# Altium schematic sheet Offset_Selector.SchDoc: Offset
size 420 x 297 mm; CheckedBy: G. Kasprowicz; Author: Jakub Kajzer; CompanyName: WUT ISE; DrawnBy: Jakub Kajzer; Organization: WUT ISE; Address1: PW ISE; Address2: Nowowiejska 15/19 00-665 Warsaw; Address3: gkasprow@gmail.com; DocumentNumber: 4; Revision: 2; SheetNumber: 4; SheetTotal: 7; ModifiedBy: -; CreateDate: 03.08.2020; CheckedDate: -; Title2: Selector; DivGrp: WUT ISE; Designer: Jakub Kajzer; ModifiedDate: -; ProjectName: Sensor Box
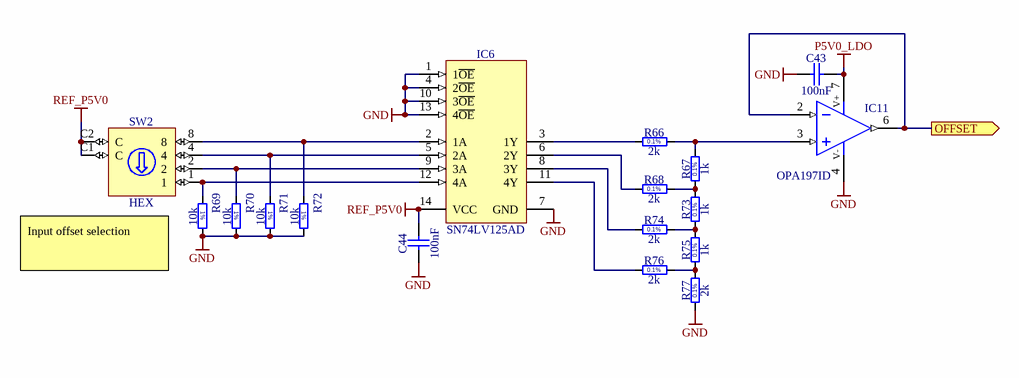
[diagram p0: Offset_Selector.SchDoc]

## Parts
C43  100nF  [CAPC1608X87N]
C44  100nF  [CAPC1608X87N]
IC6  SN74LV125AD  [SOIC127P600X175-14N]
IC11  OPA197ID  [SOIC127P600X175-8N]
R66  2k  [RESC1608X55N]
R67  1k  [RESC1608X55N]
R68  2k  [RESC1608X55N]
R69  10k  [RESC1608X55N]
R70  10k  [RESC1608X55N]
R71  10k  [RESC1608X55N]
R72  10k  [RESC1608X55N]
R73  1k  [RESC1608X55N]
R74  2k  [RESC1608X55N]
R75  1k  [RESC1608X55N]
R76  2k  [RESC1608X55N]
R77  2k  [RESC1608X55N]
SW2  HEX  [SW_APEM_PT65106L254]

## Ports
OFFSET (out)

## Nets
GND: C43.1 C44.1 IC6.1(1~{OE}) IC6.4(2~{OE}) IC6.7(GND) IC6.10(3~{OE}) IC6.13(4~{OE}) IC11.4(V-) R69.2 R70.2 R71.2 R72.2 R77.1
P5V0_LDO: C43.2 IC11.7(V+)
REF_P5V0: C44.2 IC6.14(VCC) SW2.C1(C) SW2.C2(C)
OFFSET: IC11.2(IN-) IC11.6(OUT) ; port OFFSET
NetIC6_2: IC6.2(1A) R72.1 SW2.8
NetIC6_3: IC6.3(1Y) R66.1
NetIC6_5: IC6.5(2A) R71.1 SW2.4
NetIC6_6: IC6.6(2Y) R68.1
NetIC6_8: IC6.8(3Y) R74.1
NetIC6_9: IC6.9(3A) R70.1 SW2.2
NetIC6_11: IC6.11(4Y) R76.1
NetIC6_12: IC6.12(4A) R69.1 SW2.1
NetIC11_3: IC11.3(IN+) R66.2 R67.2
NetR67_1: R67.1 R68.2 R73.2
NetR73_1: R73.1 R74.2 R75.2
NetR75_1: R75.1 R76.2 R77.2

## Notes on the sheet
- Input offset selection
- Project/Equipment
- Document
- Designer
- Drawn by
- Check.by
- Copyright WUT ISE 2018.
  This documentation describes Open Hardware and is licensed under the CERN OHL v.1.1. You may redistribute and modify this documentation under the terms of the CERN OHL v.1.1. (http://ohwr.org/CERNOHL). This documentation is distributed WITHOUT ANY EXPRESS OR IMPLIED WARRANTY, INCLUDING OF MERCHANTABILITY, SATISFACTORY QUALITY AND FITNESS FOR A PARTICULAR PURPOSE. Please see the CERN OHL v.1.1 for applicable conditions.
- Contact
- File
- Last Mod.
- Print Date
- Sheet
- Size
- A3
- of
- Rev
- (in symbol R0603_1K0_0.1%_0.063W_10PPM) 0.1%
- (in symbol R0603_2K_0.1%_0.063W_10PPM) 0.1%
- (in symbol R0603_10K_1%_0.1W_100PPM) 1%

## Library data of the parts
C43 C44 = CC0603_100NF_50V_10%_X7R: Non-polarised capacitor; Part Description: SMD Multilayer Chip Ceramic Capacitor; Manufacturer: GENERIC; Manufacturer1 Part Number: 223858615649; Voltage: 50V; TC: X7R; Tolerance: ±10%; Part Number: CC0603_100NF_50V_10%_X7R; Component Kind: Standard; Component Type: Standard; Pin Count: 2; Value: 100nF; Status: Preferred; Manufacturer Part Number: CC0603_100NF_50V_10%_X7R; Case: 0603; Mounted: Yes; Socket: No; SMD: Yes; Sense: No; Manufacturer1 Example: PHYCOMP; Manufacturer1 ComponentHeight: 0.87mm; HelpURL: \\cern.ch\dfs\Applications\Altium\Datasheets\CC0603_X7R_PHYCOMP.pdf; Author: CERN DEM JLC; CreateDate: 03/12/2007; LatestRevisionDate: 03/12/2007
IC6 = SN74LV125AD: Quadruple Bus Buffer with 3-State Outputs; Manufacturer: TEXAS INSTRUMENTS; PressFit: No; Bonding: No; Part Number: SN74LV125AD; Component Kind: Standard; Component Type: Standard; Device: SN74LV125AD; PackageDescription: SOIC 14, Pitch 1.27mm - Body 4x8.75mm, IPC Medium Density; Part Description: Quadruple Bus Buffer with 3-State Outputs; Manufacturer Part Number: SN74LV125AD; Pin Count: 14; Case: SOIC14; Mounted: Yes; Socket: No; SMD: Yes; Sense: No; ComponentHeight: 1.75mm; Author: CERN DEM JLC; HelpURL: \\cern.ch\dfs\Applications\Altium\Datasheets\SN74LV125AD.pdf; CreateDate: 09.03.2011; LatestRevisionDate: 09.03.2011
IC11 = OPA197ID: Operational Amplifier; Part Description: 36-V, Precision, Rail-to-Rail Input/Output, Low Offset Voltage, Operational Amplifiers; Manufacturer: TEXAS INSTRUMENTS; PressFit: No; Bonding: No; Part Number: OPA197ID; Component Kind: Standard; Component Type: Standard; Device: OPA197ID; PackageDescription: SOIC 8, Pitch 1.27mm - Body 4x5mm, IPC Medium Density; Manufacturer Part Number: OPA197ID; Pin Count: 8; Case: SOIC8; Mounted: Yes; Socket: No; SMD: Yes; Sense: No; ComponentHeight: 1.75mm; Author: CERN DEM MR; HelpURL: \\cern.ch\dfs\Applications\Altium\Datasheets\OPA197ID.pdf; CreateDate: 30/06/2017; LatestRevisionDate: 30/06/2017
R66 R68 R74 R76 R77 = R0603_2K_0.1%_0.063W_10PPM: Resistor - 0.1%; Part Description: Thin Film Chip Resistor; Manufacturer: GENERIC; Manufacturer1 Part Number: RN73C1J2K0BTDF; Power: 0.063W; TC: ±10ppm; PressFit: No; Part Number: R0603_2K_0.1%_0.063W_10PPM; Component Kind: Standard; Component Type: Standard; Pin Count: 2; Value: 2k; Status: Not Recommended; Tolerance: ±0.1%; Manufacturer Part Number: R0603_2K_0.1%_0.063W_10PPM; Case: 0603; Mounted: Yes; Sense: No; Socket: No; SMD: Yes; Manufacturer1 Example: TYCO HOLSWORTHY; Manufacturer1 ComponentHeight: 0.5mm; HelpURL: \\cern.ch\dfs\Applications\Altium\Datasheets\R0603_Tyco_RN73.pdf; Author: CERN DEM JLC; CreateDate: 03.12.2007; LatestRevisionDate: 13.03.2008
R67 R73 R75 = R0603_1K0_0.1%_0.063W_10PPM: Resistor - 0.1%; Part Description: Thin Film Chip Resistor; Manufacturer: GENERIC; Manufacturer1 Part Number: RN73C1J1K0BTDF; Power: 0.063W; TC: ±10ppm; PressFit: No; Part Number: R0603_1K0_0.1%_0.063W_10PPM; Component Kind: Standard; Component Type: Standard; Pin Count: 2; Value: 1k; Status: Not Recommended; Tolerance: ±0.1%; Manufacturer Part Number: R0603_1K0_0.1%_0.063W_10PPM; Case: 0603; Mounted: Yes; Sense: No; Socket: No; SMD: Yes; Manufacturer1 Example: TYCO HOLSWORTHY; Manufacturer1 ComponentHeight: 0.5mm; HelpURL: \\cern.ch\dfs\Applications\Altium\Datasheets\R0603_Tyco_RN73.pdf; Author: CERN DEM JLC; CreateDate: 03.12.2007; LatestRevisionDate: 13.03.2008
R69-R72 = R0603_10K_1%_0.1W_100PPM: Resistor - 1%; Part Description: General Purpose Thick Film Chip Resistor; Manufacturer: GENERIC; Manufacturer1 Part Number: NRC06F1002TRF; Power: 0.1W; TC: ±100ppm/°C; PressFit: No; Part Number: R0603_10K_1%_0.1W_100PPM; Component Kind: Standard; Component Type: Standard; Pin Count: 2; Value: 10k; Status: Preferred; Tolerance: ±1%; Manufacturer Part Number: R0603_10K_1%_0.1W_100PPM; Case: 0603; Mounted: Yes; Sense: No; Socket: No; SMD: Yes; Manufacturer1 Example: NIC COMPONENT; Manufacturer1 ComponentHeight: 0.55mm; HelpURL: \\cern.ch\dfs\Applications\Altium\Datasheets\R0603_NIC_NRC.pdf; Author: CERN DEM JLC; CreateDate: 03.12.2007; LatestRevisionDate: 13.03.2008
SW2 = SW_APEM_PT65106L254: Rotary Code Switch 1 2 4 8 C1 C2; Part Description: Rotary Hexadecimal Right Angled Switch, Screwdriver Actuator, Straight terminals; Manufacturer: APEM; PressFit: No; Part Number: SW_APEM_PT65106L254; Component Kind: Standard; Component Type: Standard; Pin Count: 6; PackageDescription: Body 10x10mm, Right Angled Rotary Hexadecimal Code Switch With Screwdriver Actuator, APEM PT65 (CR65) Series; Family: HEX; Mounted: Yes; Socket: No; SMD: No; Sense: No; Status: None; Manufacturer Part Number: PT65106L254; ComponentHeight: 10mm; HelpURL: \\cern.ch\dfs\Applications\Altium\Datasheets\SW_APEM_PT65106L254.pdf; Author: CERN DEM JLC; CreateDate: 18.06.2014; LatestRevisionDate: 18.06.2014